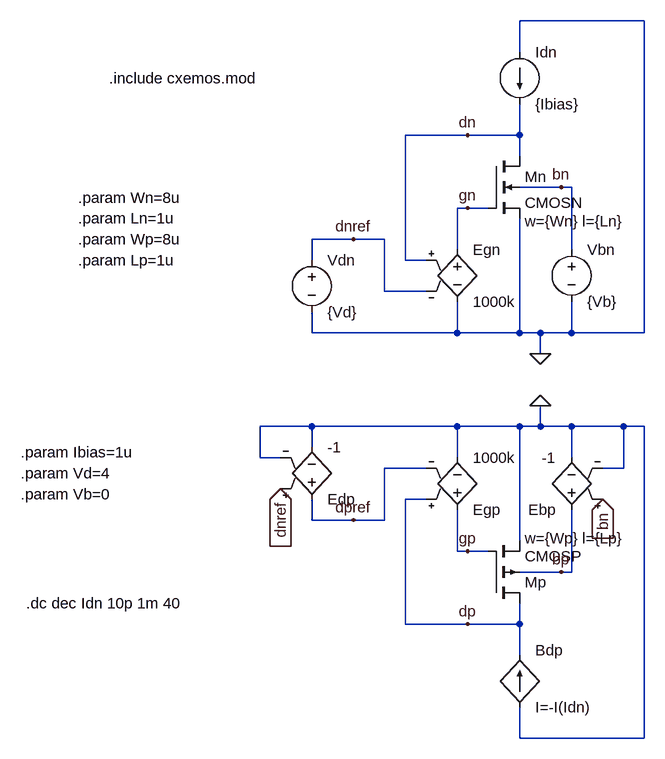
[diagram p0: schematic mos.amscxe.asc]
mos.amscxe.asc, the LTspice schematic file:
Version 4
SHEET 1 2088 996
WIRE 1520 -288 1328 -288
WIRE 1328 -240 1328 -288
WIRE 1248 -112 1152 -112
WIRE 1328 -112 1328 -160
WIRE 1328 -112 1248 -112
WIRE 1328 -80 1328 -112
WIRE 1392 -32 1328 -32
WIRE 1408 -32 1392 -32
WIRE 1248 0 1232 0
WIRE 1280 0 1248 0
WIRE 1072 48 1008 48
WIRE 1120 48 1072 48
WIRE 1232 64 1232 0
WIRE 1408 64 1408 -32
WIRE 1008 80 1008 48
WIRE 1152 80 1152 -112
WIRE 1184 80 1152 80
WIRE 1120 128 1120 48
WIRE 1184 128 1120 128
WIRE 1008 192 1008 160
WIRE 1232 192 1232 144
WIRE 1232 192 1008 192
WIRE 1328 192 1328 16
WIRE 1328 192 1232 192
WIRE 1360 192 1328 192
WIRE 1408 192 1408 144
WIRE 1408 192 1360 192
WIRE 1520 192 1520 -288
WIRE 1520 192 1408 192
WIRE 1360 224 1360 192
WIRE 1008 336 928 336
WIRE 1232 336 1008 336
WIRE 1328 336 1232 336
WIRE 1360 336 1360 304
WIRE 1360 336 1328 336
WIRE 1408 336 1360 336
WIRE 1488 336 1408 336
WIRE 1520 336 1488 336
WIRE 1008 368 1008 336
WIRE 928 384 928 336
WIRE 960 384 928 384
WIRE 1232 384 1232 336
WIRE 1408 384 1408 336
WIRE 1184 400 1120 400
WIRE 1488 400 1488 336
WIRE 1488 400 1456 400
WIRE 1184 448 1152 448
WIRE 1008 480 1008 448
WIRE 1072 480 1008 480
WIRE 1120 480 1120 400
WIRE 1120 480 1072 480
WIRE 1328 512 1328 336
WIRE 1232 528 1232 464
WIRE 1248 528 1232 528
WIRE 1280 528 1248 528
WIRE 1392 560 1328 560
WIRE 1408 560 1408 464
WIRE 1408 560 1392 560
WIRE 1152 640 1152 448
WIRE 1248 640 1152 640
WIRE 1328 640 1328 608
WIRE 1328 640 1248 640
WIRE 1328 688 1328 640
WIRE 1328 816 1328 768
WIRE 1520 816 1520 336
WIRE 1520 816 1328 816
FLAG 1360 224 0
FLAG 1248 0 gn
FLAG 1248 -112 dn
FLAG 1072 48 dnref
FLAG 1392 -32 bn
FLAG 1360 304 0
FLAG 1248 528 gp
FLAG 1248 640 dp
FLAG 1072 480 dpref
FLAG 1392 560 bp
FLAG 960 432 dnref
IOPIN 960 432 In
FLAG 1456 448 bn
IOPIN 1456 448 In
SYMBOL nmos4 1280 -80 R0
WINDOW 123 56 100 Left 0
SYMATTR Value2 w={Wn} l={Ln}
SYMATTR InstName Mn
SYMATTR Value CMOSN
SYMBOL voltage 1008 64 R0
SYMATTR InstName Vdn
SYMATTR Value {Vd}
SYMBOL e 1232 48 R0
SYMATTR InstName Egn
SYMATTR Value 1000k
SYMBOL current 1328 -240 R0
SYMATTR InstName Idn
SYMATTR Value {Ibias}
SYMBOL voltage 1408 48 R0
SYMATTR InstName Vbn
SYMATTR Value {Vb}
SYMBOL e 1232 480 M180
SYMATTR InstName Egp
SYMATTR Value 1000k
SYMBOL pmos4 1280 608 M180
WINDOW 123 56 100 Left 0
SYMATTR Value2 w={Wp} l={Lp}
SYMATTR InstName Mp
SYMATTR Value CMOSP
SYMBOL e 1008 464 M180
SYMATTR InstName Edp
SYMATTR Value -1
SYMBOL e 1408 480 R180
SYMATTR InstName Ebp
SYMATTR Value -1
SYMBOL bi 1328 768 M180
WINDOW 0 24 88 Left 0
WINDOW 3 24 0 Left 0
SYMATTR InstName Bdp
SYMATTR Value I=-I(Idn)
TEXT 560 376 Left 0 !.param Ibias=1u
TEXT 560 408 Left 0 !.param Vd=4
TEXT 568 608 Left 0 !.dc dec Idn 10p 1m 40
TEXT 560 440 Left 0 !.param Vb=0
TEXT 648 -16 Left 0 !.param Wn=8u
TEXT 648 16 Left 0 !.param Ln=1u
TEXT 648 48 Left 0 !.param Wp=8u
TEXT 648 80 Left 0 !.param Lp=1u
TEXT 696 -200 Left 0 !.include cxemos.mod

The netlist it stands for:
* mos.amscxe.asc
Mn dn gn 0 bn CMOSN w={Wn} l={Ln}
Vdn dnref 0 {Vd}
Egn gn 0 dn dnref 1000k
Idn 0 dn {Ibias}
Vbn bn 0 {Vb}
Egp gp 0 dp dpref 1000k
Mp dp gp 0 bp CMOSP w={Wp} l={Lp}
Edp dpref 0 dnref 0 -1
Ebp bp 0 bn 0 -1
Bdp 0 dp I=-I(Idn)
.model NMOS NMOS
.model PMOS PMOS
.lib standard.mos
.param Ibias=1u
.param Vd=4
.dc dec Idn 10p 1m 40
.param Vb=0
.param Wn=8u
.param Ln=1u
.param Wp=8u
.param Lp=1u
.include cxemos.mod
.backanno
.end